# Altium schematic sheet principal_input.SchDoc
size 420 x 297 mm
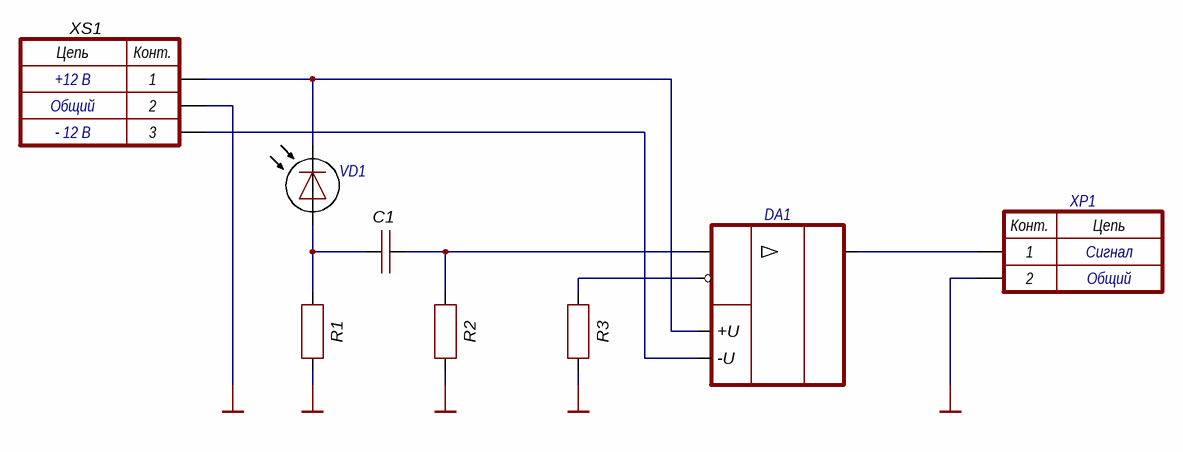
[diagram p0: principal_input.SchDoc]

## Parts
C1  C  [C_1206]  (value not drawn)
DA1  OU  (value not drawn)
R1  R  [R_1206]  (value not drawn)
R2  R  [R_1206]  (value not drawn)
R3  R  [R_1206]  (value not drawn)
VD1  VD  (value not drawn)
XP1  X_2  (value not drawn)
XS1  X_3  [PCBComponent_1]  (value not drawn)

## Nets
GND: R1.2 R2.2 R3.2 XP1.2 XS1.2
NetC1_1: C1.1 R1.1 VD1.1(A)
NetC1_2: C1.2 DA1.1 R2.1
NetDA1_2: DA1.2 R3.1
NetDA1_3: DA1.3(+U) VD1.2(C) XS1.1
NetDA1_4: DA1.4(-U) XS1.3
NetDA1_5: DA1.5 XP1.1

## Notes on the sheet
- +12 В
- - 12 В
- Общий
- Сигнал
- Перв. примен.
- Справ. №
- Подп. и дата
- Инв. № дубл.
- Взам. инв. №
- Разраб.
- Изм.
- Лист
- № докум.
- Подп.
- Дата
- Лит.
- Масса
- Масштаб
- Пров.
- Т. контр.
- Листов
- Инв. № подл.
- Н. контр.
- Утв.
- Копировал
- Формат А3
- (in symbol X_2) Конт.; Цепь
- (in symbol X_3) Цепь; Конт.

## Library data of the parts
VD1 = photodiode